# Altium schematic sheet EEM_FMC_Carrier.SchDoc
size 420 x 297 mm; EDA_Number: ARTIQ; CompanyName: WUT ISE; Organization: WUT ISE; DocumentNumber: 1; SheetNumber: 1; Title2: Top; ModifiedDate: -
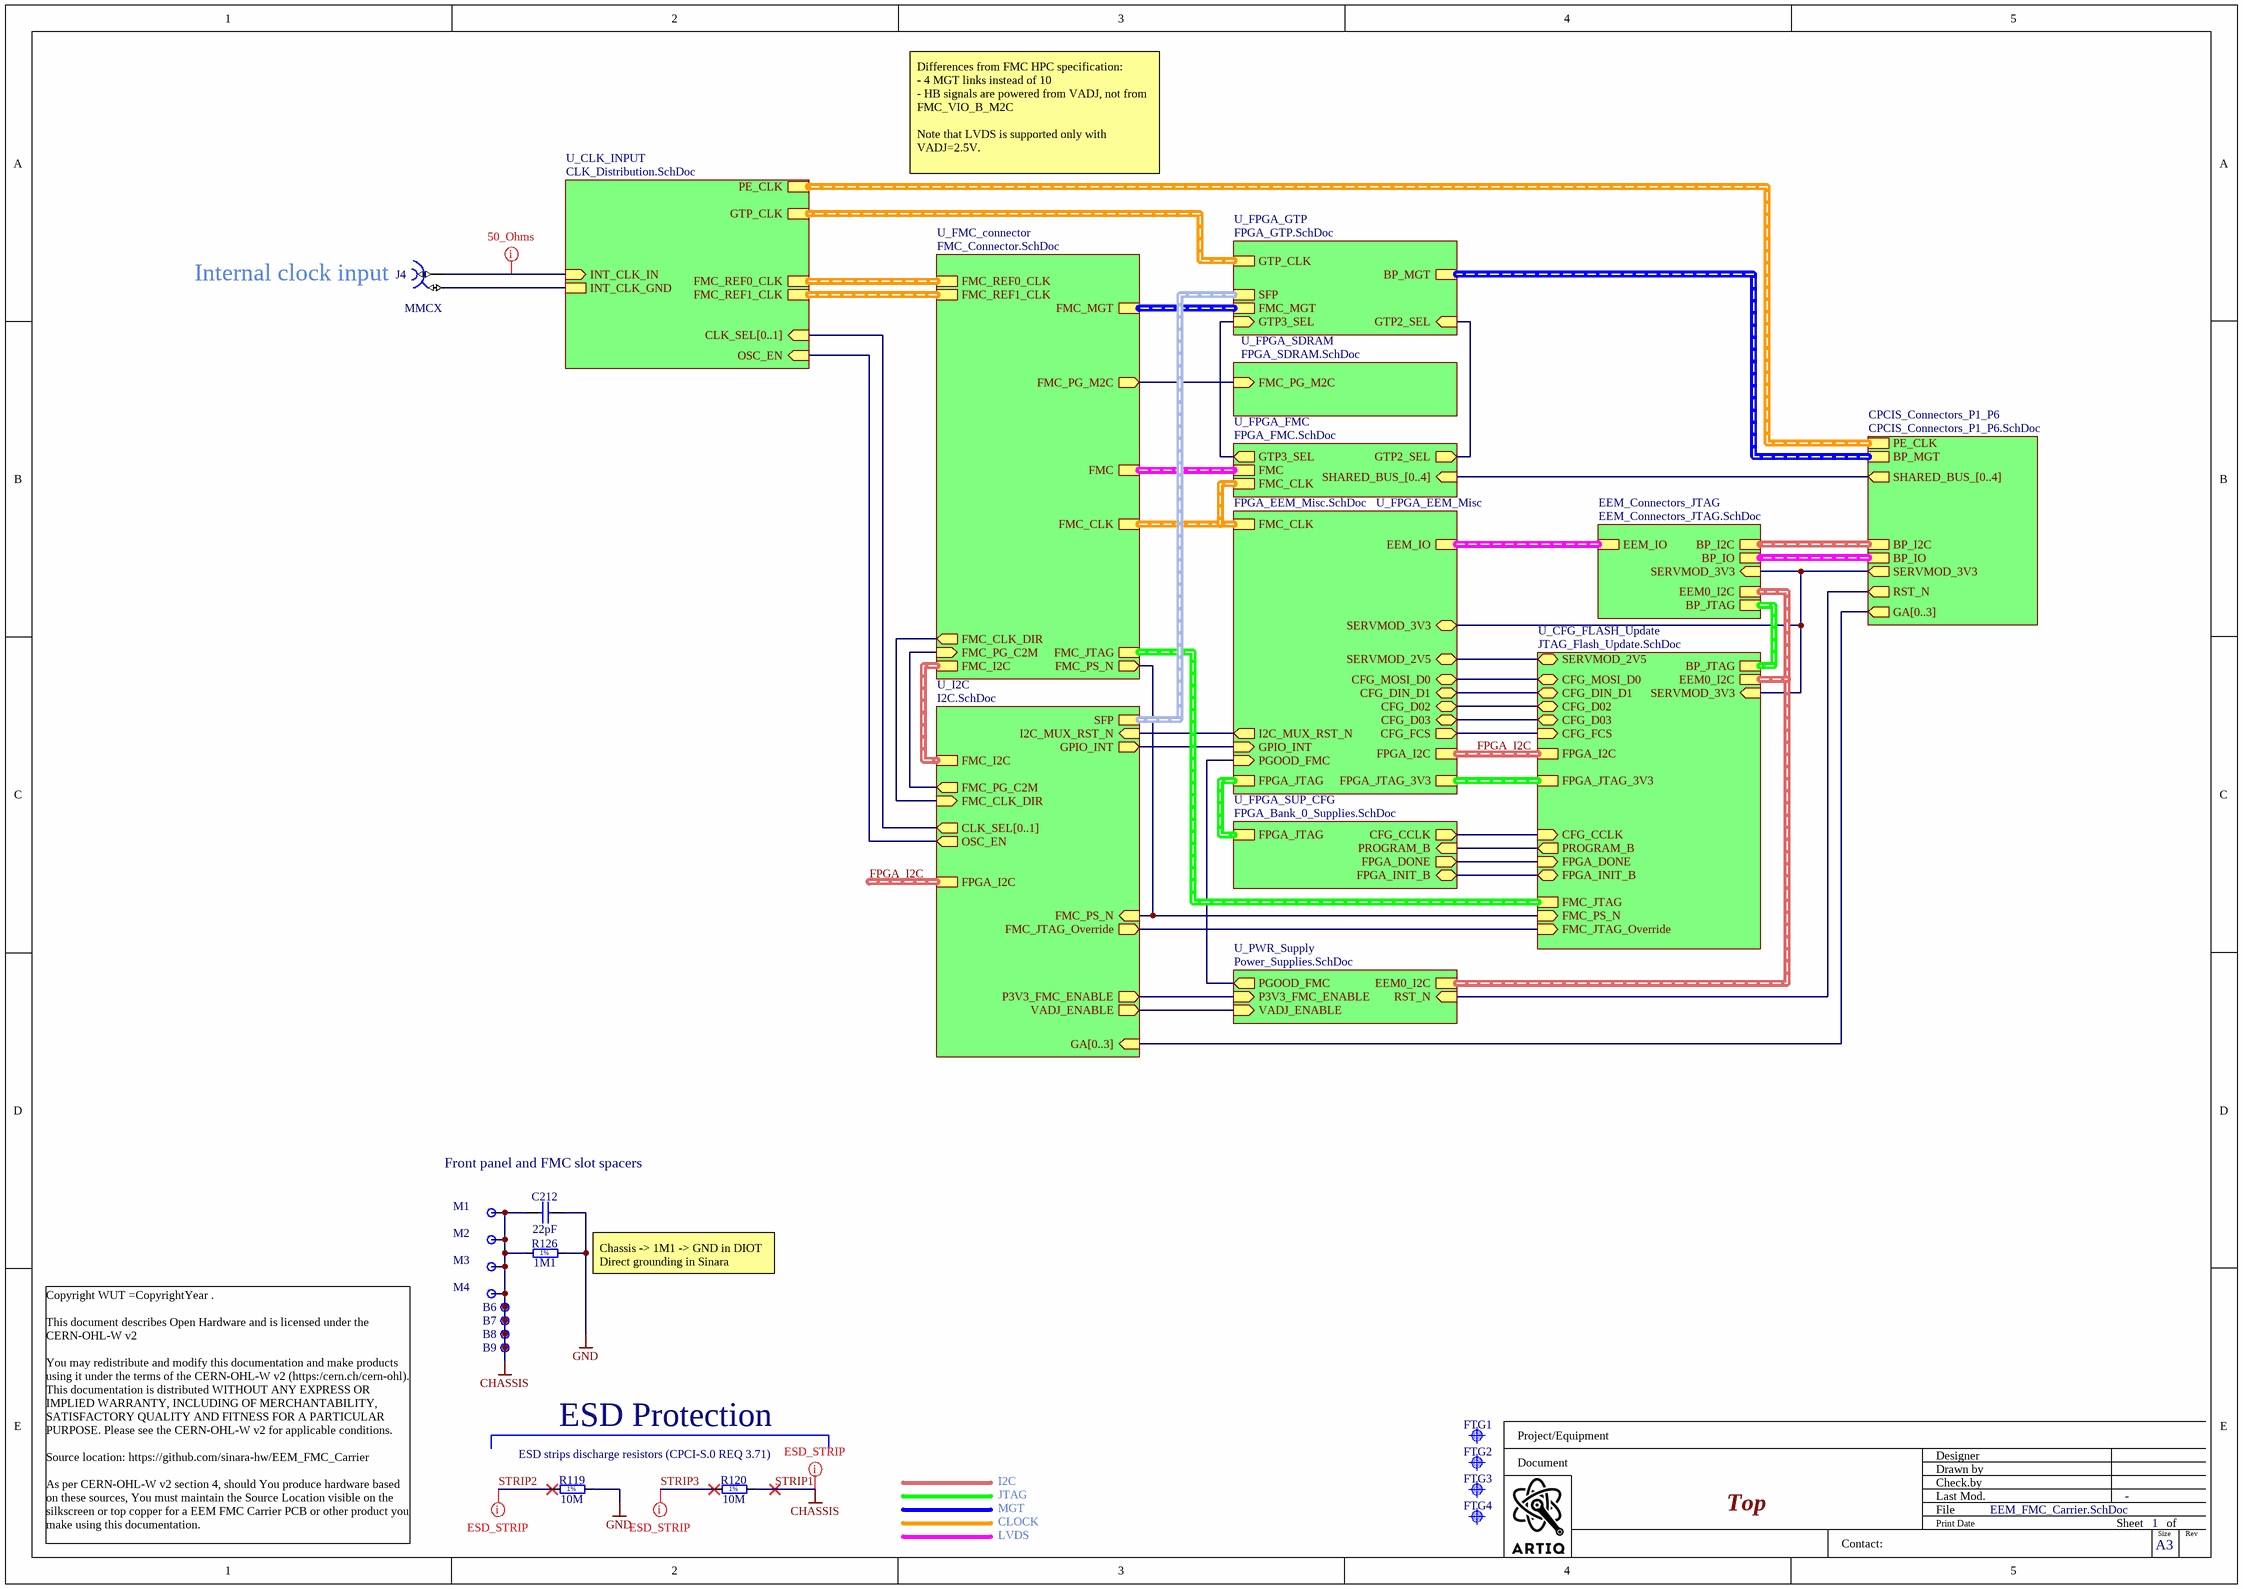
[diagram p0: EEM_FMC_Carrier.SchDoc]

## Parts
B6  Plated Hole  [MTG270_500]  (value not drawn)  (no BOM)
B7  Plated Hole  [MTG270_500]  (value not drawn)  (no BOM)
B8  Plated Hole  [MTG270_500]  (value not drawn)  (no BOM)
B9  Plated Hole  [MTG270_500]  (value not drawn)  (no BOM)
C212  22pF  [CAPC1005X55N]
FTG1  Use only in PCB  [FIDUCIAL_TOP_C100-200]  (value not drawn)
FTG2  Use only in PCB  [FIDUCIAL_TOP_S100-200]  (value not drawn)
FTG3  Use only in PCB  [FIDUCIAL_TOP_S100-200]  (value not drawn)
FTG4  Use only in PCB  [FIDUCIAL_TOP_S100-200]  (value not drawn)
J4  MMCX  [SAMTEC_MMCX-J-P-H-ST-TH1]
M1  Plated Hole  [MTG300_600]  (value not drawn)  (no BOM)
M2  Plated Hole  [MTG300_600]  (value not drawn)  (no BOM)
M3  Plated Hole  [MTG300_600]  (value not drawn)  (no BOM)
M4  Plated Hole  [MTG300_600]  (value not drawn)  (no BOM)
R119  10M  [RESC2113X55N]
R120  10M  [RESC2113X55N]
R126  1M1  [RESC2012X60N]

## Sub-sheets
CPCIS_Connectors_P1_P6 = CPCIS_Connectors_P1_P6.SchDoc: BP_I2C (harness I2C), SERVMOD_3V3 (out), RST_N (out), PE_CLK (harness CLK_DIFF), BP_MGT (harness MGT), GA[0..3] (out), BP_IO (harness EEM_LVDS), SHARED_BUS_[0..4] (out)
EEM_Connectors_JTAG = EEM_Connectors_JTAG.SchDoc: BP_JTAG (harness JTAG5), EEM_IO (harness EEM_LVDS), BP_IO (harness EEM_LVDS), EEM0_I2C (harness I2C), BP_I2C (harness I2C), SERVMOD_3V3 (in)
U_CFG_FLASH_Update = JTAG_Flash_Update.SchDoc: CFG_MOSI_D0 (bidir), CFG_DIN_D1 (bidir), CFG_D02 (bidir), CFG_D03 (bidir), CFG_FCS (in), CFG_CCLK (in), FPGA_DONE (in), FPGA_INIT_B (bidir), PROGRAM_B (out), SERVMOD_3V3 (in), EEM0_I2C (harness I2C), FMC_PS_N (in), FMC_JTAG_Override (in), FPGA_JTAG_3V3 (harness JTAG5), BP_JTAG (harness JTAG5), FMC_JTAG (harness JTAG5), FPGA_I2C (harness I2C), SERVMOD_2V5 (bidir)
U_CLK_INPUT = CLK_Distribution.SchDoc: INT_CLK_IN (in), INT_CLK_GND, PE_CLK (harness CLK_DIFF), FMC_REF1_CLK (harness CLK_DIFF), FMC_REF0_CLK (harness CLK_DIFF), GTP_CLK (harness CLK_DIFF), CLK_SEL[0..1] (in), OSC_EN (in)
U_FMC_connector = FMC_Connector.SchDoc: FMC_REF1_CLK (harness CLK_DIFF), FMC_REF0_CLK (harness CLK_DIFF), FMC_CLK (harness FMC_CLK), FMC_PG_M2C (out), FMC_I2C (harness I2C), FMC_MGT (harness FMC_MGT), FMC_JTAG (harness JTAG5), FMC (harness FMC), FMC_PS_N (out), FMC_PG_C2M (in), FMC_CLK_DIR (out)
U_FPGA_EEM_Misc = FPGA_EEM_Misc.SchDoc: CFG_DIN_D1 (bidir), CFG_FCS (out), CFG_MOSI_D0 (bidir), CFG_D02 (bidir), CFG_D03 (bidir), FMC_CLK (harness FMC_CLK), EEM_IO (harness EEM_LVDS), FPGA_I2C (harness I2C), PGOOD_FMC (in), FPGA_JTAG (harness JTAG5), FPGA_JTAG_3V3 (harness JTAG5), SERVMOD_2V5 (bidir), SERVMOD_3V3 (bidir), I2C_MUX_RST_N (out), GPIO_INT (in)
U_FPGA_FMC = FPGA_FMC.SchDoc: FMC (harness FMC), FMC_CLK (harness FMC_CLK), SHARED_BUS_[0..4] (in), GTP3_SEL (out), GTP2_SEL (out)
U_FPGA_GTP = FPGA_GTP.SchDoc: FMC_MGT (harness FMC_MGT), BP_MGT (harness MGT), GTP_CLK (harness CLK_DIFF), GTP3_SEL (in), SFP (harness SFP), GTP2_SEL (in)
U_FPGA_SDRAM = FPGA_SDRAM.SchDoc: FMC_PG_M2C (in)
U_FPGA_SUP_CFG = FPGA_Bank_0_Supplies.SchDoc: FPGA_INIT_B (bidir), FPGA_DONE (out), CFG_CCLK (out), PROGRAM_B (in), FPGA_JTAG (harness JTAG5)
U_I2C = I2C.SchDoc: FMC_CLK_DIR (in), FMC_I2C (harness I2C), FMC_PS_N (in), FMC_PG_C2M (out), CLK_SEL[0..1] (out), GA[0..3] (in), FPGA_I2C (harness I2C), FMC_JTAG_Override (out), P3V3_FMC_ENABLE (out), VADJ_ENABLE (out), OSC_EN (out), SFP (harness SFP), I2C_MUX_RST_N (in), GPIO_INT (out)
U_PWR_Supply = Power_Supplies.SchDoc: RST_N (in), VADJ_ENABLE (in), P3V3_FMC_ENABLE (in), PGOOD_FMC (out), EEM0_I2C (harness I2C)

## Nets
GND: C212.2 R119.2 R126.2
STRIP1: B6.1 B7.1 B8.1 B9.1 C212.1 M1.1 M2.1 M3.1 M4.1 R120.2 R126.1  [also labelled CHASSIS]
STRIP2: R119.1
STRIP3: R120.1
NetJ4_1: J4.1 ; sheet U_CLK_INPUT/INT_CLK_IN
NetJ4_2: J4.2 ; sheet U_CLK_INPUT/INT_CLK_GND
(unnamed): sheet U_FPGA_EEM_Misc/CFG_DIN_D1, sheet U_CFG_FLASH_Update/CFG_DIN_D1
(unnamed): sheet U_FPGA_EEM_Misc/CFG_FCS, sheet U_CFG_FLASH_Update/CFG_FCS
(unnamed): sheet U_FPGA_EEM_Misc/CFG_MOSI_D0, sheet U_CFG_FLASH_Update/CFG_MOSI_D0
(unnamed): sheet U_FPGA_EEM_Misc/CFG_D02, sheet U_CFG_FLASH_Update/CFG_D02
(unnamed): sheet U_FPGA_EEM_Misc/CFG_D03, sheet U_CFG_FLASH_Update/CFG_D03
(unnamed): sheet U_FPGA_EEM_Misc/PGOOD_FMC, sheet U_PWR_Supply/PGOOD_FMC
(unnamed): sheet U_FPGA_EEM_Misc/SERVMOD_2V5, sheet U_CFG_FLASH_Update/SERVMOD_2V5
(unnamed): sheet U_FPGA_EEM_Misc/SERVMOD_3V3, sheet U_CFG_FLASH_Update/SERVMOD_3V3, sheet CPCIS_Connectors_P1_P6/SERVMOD_3V3, sheet EEM_Connectors_JTAG/SERVMOD_3V3
(unnamed): sheet U_FPGA_EEM_Misc/I2C_MUX_RST_N, sheet U_I2C/I2C_MUX_RST_N
(unnamed): sheet U_FPGA_EEM_Misc/GPIO_INT, sheet U_I2C/GPIO_INT
(unnamed): sheet U_PWR_Supply/RST_N, sheet CPCIS_Connectors_P1_P6/RST_N
(unnamed): sheet U_PWR_Supply/VADJ_ENABLE, sheet U_I2C/VADJ_ENABLE
(unnamed): sheet U_PWR_Supply/P3V3_FMC_ENABLE, sheet U_I2C/P3V3_FMC_ENABLE
(unnamed): sheet U_CLK_INPUT/OSC_EN, sheet U_I2C/OSC_EN
(unnamed): sheet U_FPGA_FMC/GTP3_SEL, sheet U_FPGA_GTP/GTP3_SEL
(unnamed): sheet U_FPGA_FMC/GTP2_SEL, sheet U_FPGA_GTP/GTP2_SEL
(unnamed): sheet U_FPGA_SUP_CFG/FPGA_INIT_B, sheet U_CFG_FLASH_Update/FPGA_INIT_B
(unnamed): sheet U_FPGA_SUP_CFG/FPGA_DONE, sheet U_CFG_FLASH_Update/FPGA_DONE
(unnamed): sheet U_FPGA_SUP_CFG/CFG_CCLK, sheet U_CFG_FLASH_Update/CFG_CCLK
(unnamed): sheet U_FPGA_SUP_CFG/PROGRAM_B, sheet U_CFG_FLASH_Update/PROGRAM_B
(unnamed): sheet U_FPGA_SDRAM/FMC_PG_M2C, sheet U_FMC_connector/FMC_PG_M2C
(unnamed): sheet U_CFG_FLASH_Update/FMC_PS_N, sheet U_FMC_connector/FMC_PS_N, sheet U_I2C/FMC_PS_N
(unnamed): sheet U_CFG_FLASH_Update/FMC_JTAG_Override, sheet U_I2C/FMC_JTAG_Override
(unnamed): sheet U_FMC_connector/FMC_PG_C2M, sheet U_I2C/FMC_PG_C2M
(unnamed): sheet U_FMC_connector/FMC_CLK_DIR, sheet U_I2C/FMC_CLK_DIR

## Buses and harness runs
bus sheet CPCIS_Connectors_P1_P6/GA[0..3] = sheet U_I2C/GA[0..3]
bus sheet CPCIS_Connectors_P1_P6/SHARED_BUS_[0..4] = sheet U_FPGA_FMC/SHARED_BUS_[0..4]
bus sheet U_CLK_INPUT/CLK_SEL[0..1] = sheet U_I2C/CLK_SEL[0..1]
harness FPGA_I2C = sheet U_CFG_FLASH_Update/FPGA_I2C = sheet U_FPGA_EEM_Misc/FPGA_I2C
harness FPGA_I2C = sheet U_I2C/FPGA_I2C
harness sheet CPCIS_Connectors_P1_P6/BP_I2C = sheet EEM_Connectors_JTAG/BP_I2C
harness sheet CPCIS_Connectors_P1_P6/BP_IO = sheet EEM_Connectors_JTAG/BP_IO
harness sheet CPCIS_Connectors_P1_P6/BP_MGT = sheet U_FPGA_GTP/BP_MGT
harness sheet CPCIS_Connectors_P1_P6/PE_CLK = sheet U_CLK_INPUT/PE_CLK
harness sheet EEM_Connectors_JTAG/BP_JTAG = sheet U_CFG_FLASH_Update/BP_JTAG
harness sheet EEM_Connectors_JTAG/EEM0_I2C = sheet U_CFG_FLASH_Update/EEM0_I2C = sheet U_PWR_Supply/EEM0_I2C
harness sheet EEM_Connectors_JTAG/EEM_IO = sheet U_FPGA_EEM_Misc/EEM_IO
harness sheet U_CFG_FLASH_Update/FMC_JTAG = sheet U_FMC_connector/FMC_JTAG
harness sheet U_CFG_FLASH_Update/FPGA_JTAG_3V3 = sheet U_FPGA_EEM_Misc/FPGA_JTAG_3V3
harness sheet U_CLK_INPUT/FMC_REF0_CLK = sheet U_FMC_connector/FMC_REF0_CLK
harness sheet U_CLK_INPUT/FMC_REF1_CLK = sheet U_FMC_connector/FMC_REF1_CLK
harness sheet U_CLK_INPUT/GTP_CLK = sheet U_FPGA_GTP/GTP_CLK
harness sheet U_FMC_connector/FMC = sheet U_FPGA_FMC/FMC
harness sheet U_FMC_connector/FMC_CLK = sheet U_FPGA_EEM_Misc/FMC_CLK = sheet U_FPGA_FMC/FMC_CLK
harness sheet U_FMC_connector/FMC_I2C = sheet U_I2C/FMC_I2C
harness sheet U_FMC_connector/FMC_MGT = sheet U_FPGA_GTP/FMC_MGT
harness sheet U_FPGA_EEM_Misc/FPGA_JTAG = sheet U_FPGA_SUP_CFG/FPGA_JTAG
harness sheet U_FPGA_GTP/SFP = sheet U_I2C/SFP

## Layout directives
net class 50Ohm: NetJ4_1
net class ESD_STRIP: STRIP1, STRIP2, STRIP3

## Notes on the sheet
- Differences from FMC HPC specification:
  - 4 MGT links instead of 10
  - HB signals are powered from VADJ, not from FMC_VIO_B_M2C
  Note that LVDS is supported only with VADJ=2.5V.
- (near J4) Internal clock input
- Front panel and FMC slot spacers
- Chassis -> 1M1 -> GND in DIOT
  Direct grounding in Sinara
- ESD strips discharge resistors (CPCI-S.0 REQ 3.71)
- ESD Protection
- I2C
- JTAG
- MGT
- CLOCK
- LVDS
- Project/Equipment
- Document
- Designer
- Drawn by
- Check.by
- Copyright WUT =CopyrightYear .
  This document describes Open Hardware and is licensed under the CERN-OHL-W v2
  You may redistribute and modify this documentation and make products using it under the terms of the CERN-OHL-W v2 (https:/cern.ch/cern-ohl). This documentation is distributed WITHOUT ANY EXPRESS OR IMPLIED WARRANTY, INCLUDING OF MERCHANTABILITY, SATISFACTORY QUALITY AND FITNESS FOR A PARTICULAR PURPOSE. Please see the CERN-OHL-W v2 for applicable conditions.
  Source location: https://github.com/sinara-hw/EEM_FMC_Carrier
  As per CERN-OHL-W v2 section 4, should You produce hardware based on these sources, You must maintain the Source Location visible on the silkscreen or top copper for a EEM FMC Carrier PCB or other product you make using this documentation.
- Contact:
- File
- Last Mod.
- Print Date
- Sheet
- Size
- A3
- of
- Rev
- (in symbol R0805_1M1_1%_0.125W_100PPM) 1%
- (in symbol R0805_10M_1%_0.125W_100PPM_VISHAY_CRCW e3) 1%

## Library data of the parts
B6-B9 = PLATED_HOLE2.7_PAD5.0: Single Terminal Socket; Part Description: Plated Through Hole: Hole Dia.=2.7mm Pad Dia.=5.0mm; Mounted: No; Part Number: PLATED_HOLE2.7_PAD5.0; Component Type: Standard (No BOM); Pin Count: 1; Family: Plated Hole; Socket: No; SMD: No; Sense: No; Status: None; ComponentHeight: 0mm; HelpURL: Undefined; Author: CERN DEM JMW; CreateDate: 27.09.2011; LatestRevisionDate: 27.09.2011; PackageDescription: Plated Through Hole: Hole Dia.=2.7mm Pad Dia.=5.0mm
C212 = CC0402_22PF_50V_5%_C0G: Non-polarised capacitor; Part Description: SMD Multilayer Chip Ceramic Capacitor; Manufacturer: GENERIC; Manufacturer1 Part Number: C0402C220J5GACTU; Voltage: 50V; TC: C0G/NP0; Tolerance: ±5%; Part Number: CC0402_22PF_50V_5%_C0G; Component Kind: Standard; Component Type: Standard; Pin Count: 2; Value: 22pF; Status: Preferred; Manufacturer Part Number: CC0402_22PF_50V_5%_C0G; Case: 0402; Mounted: Yes; Socket: No; SMD: Yes; Manufacturer1 Example: KEMET; Manufacturer1 ComponentHeight: 0.55mm; HelpURL: \\cern.ch\dfs\Applications\Altium\Datasheets\CC0402_C0G_KEMET_(Commercial Grade).pdf; Author: CERN DEM JLC; CreateDate: 2007-12-03; LatestRevisionDate: 2007-12-03; Sense: No
FTG1 = FIDUCIAL_TARGET_C100-200: Fiducial Target; Part Description: Round Fiducial Target, Top Layer, 1.0mm, Top Solder 2.0mm, Keepout =2.0mm; Mounted: No; Part Number: FIDUCIAL_TARGET_C100-200; Component Kind: Standard (No BOM); Component Type: Standard (No BOM); Pin Count: 1; Family: Fiducial; Socket: No; SMD: Yes; Sense: No; Status: None; ComponentHeight: 0mm; HelpURL: Undefined; Author: CERN DEM JLC; CreateDate: 09.02.2010; LatestRevisionDate: 04.04.2012; PackageDescription: Round Fiducial Target, Top Layer, 1.0mm, Top Solder 2.0mm, Keepout =2.0mm
FTG2-FTG4 = FIDUCIAL_TARGET_S100-200: Fiducial Target; Part Description: Square Fiducial Target, Top Layer, 1.0mm, Top Solder 2.0mm, Keepout =2.0mm; Mounted: No; Part Number: FIDUCIAL_TARGET_S100-200; Component Kind: Standard (No BOM); Component Type: Standard (No BOM); Pin Count: 1; Family: Fiducial; Socket: No; SMD: Yes; Sense: No; Status: None; ComponentHeight: 0mm; HelpURL: Undefined; Author: CERN DEM JLC; CreateDate: 09.02.2010; LatestRevisionDate: 04.04.2012; PackageDescription: Square Fiducial Target, Top Layer, 1.0mm, Top Solder 2.0mm, Keepout =2.0mm
J4 = SAMTEC_MMCX-J-P-H-ST-TH1: Part Description: Straight Through-hole 50 Ohm Micro Mini RF Jack, MMCX Series; Manufacturer: SAMTEC; PressFit: No; Part Number: SAMTEC_MMCX-J-P-H-ST-TH1; Component Kind: Standard; Component Type: Standard; Pin Count: 2; Mounted: Yes; Socket: No; Sense: No; SMD: No; Status: None; Manufacturer Part Number: MMCX-J-P-H-ST-TH1; ComponentHeight: 4.35mm; HelpURL: \\cern.ch\dfs\Applications\Altium\Datasheets\SAMTEC_MMCX-J-P-H-ST-TH1.pdf; Author: CERN DEM JLC; CreateDate: 05.12.2012; LatestRevisionDate: 05.12.2012
M1-M4 = PLATED_HOLE3.0_PAD6.0: Single Terminal Socket; Part Description: Plated Through Hole: Hole Dia.=3.0mm Pad Dia.=6.0mm; Mounted: No; Table: Pads; Part Number: PLATED_HOLE3.0_PAD6.0; Component Type: Standard (No BOM); Designator: Single Terminal Socket; Library Reference: Single Terminal Socket; Pin Count: 1; Family: Plated Hole; Socket: No; SMD: No; Status: None; ComponentHeight: 0mm; Author: CERN DEM JLC; CreateDate: 26.05.2008; LatestRevisionDate: 26.05.2008; PackageDescription: Plated Through Hole: Hole Dia.=3.0mm Pad Dia.=6.0mm
R119 R120 = R0805_10M_1%_0.125W_100PPM_VISHAY_CRCW e3: Resistor - 1%; Part Description: 150V, Standard Thick Film Chip Resistor; Manufacturer: VISHAY DALE; Manufacturer Part Number: CRCW080510M0FKEA; Power: 0.125W; TC: ±100ppm/°C; PressFit: No; Part Number: R0805_10M_1%_0.125W_100PPM_VISHAY_CRCW e3; Component Kind: Standard; Component Type: Standard; Pin Count: 2; Value: 10M; Status: None; Tolerance: ±1%; Case: 0805; Mounted: Yes; Sense: No; Socket: No; SMD: Yes; ComponentHeight: 0.5mm; HelpURL: \\cern.ch\dfs\Applications\Altium\Datasheets\R0805_VISHAY_CRCW e3.pdf; Author: CERN DEM BC; CreateDate: 2019-11-12; LatestRevisionDate: 2019-11-12
R126 = R0805_1M1_1%_0.125W_100PPM: Resistor - 1%; Part Description: General Purpose Thick Film Chip Resistor; Manufacturer: GENERIC; Manufacturer1 Part Number: NRC10F1104TRF; PressFit: No; Part Number: R0805_1M1_1%_0.125W_100PPM; Component Kind: Standard; Component Type: Standard; Pin Count: 2; Value: 1M1; Status: Preferred; Manufacturer Part Number: R0805_1M1_1%_0.125W_100PPM; Case: 0805; Mounted: Yes; Sense: No; Socket: No; SMD: Yes; Manufacturer1 Example: NIC COMPONENT; Manufacturer1 ComponentHeight: 0.6mm; HelpURL: \\cern.ch\dfs\Applications\Altium\Datasheets\R0805_NIC_NRC.pdf; Author: CERN DEM JLC; CreateDate: 03/12/2007; LatestRevisionDate: 13/03/2008